# Altium schematic sheet BuckRegulator-5V.SchDoc
size A4; SheetNumber: 4; SheetTotal: 8
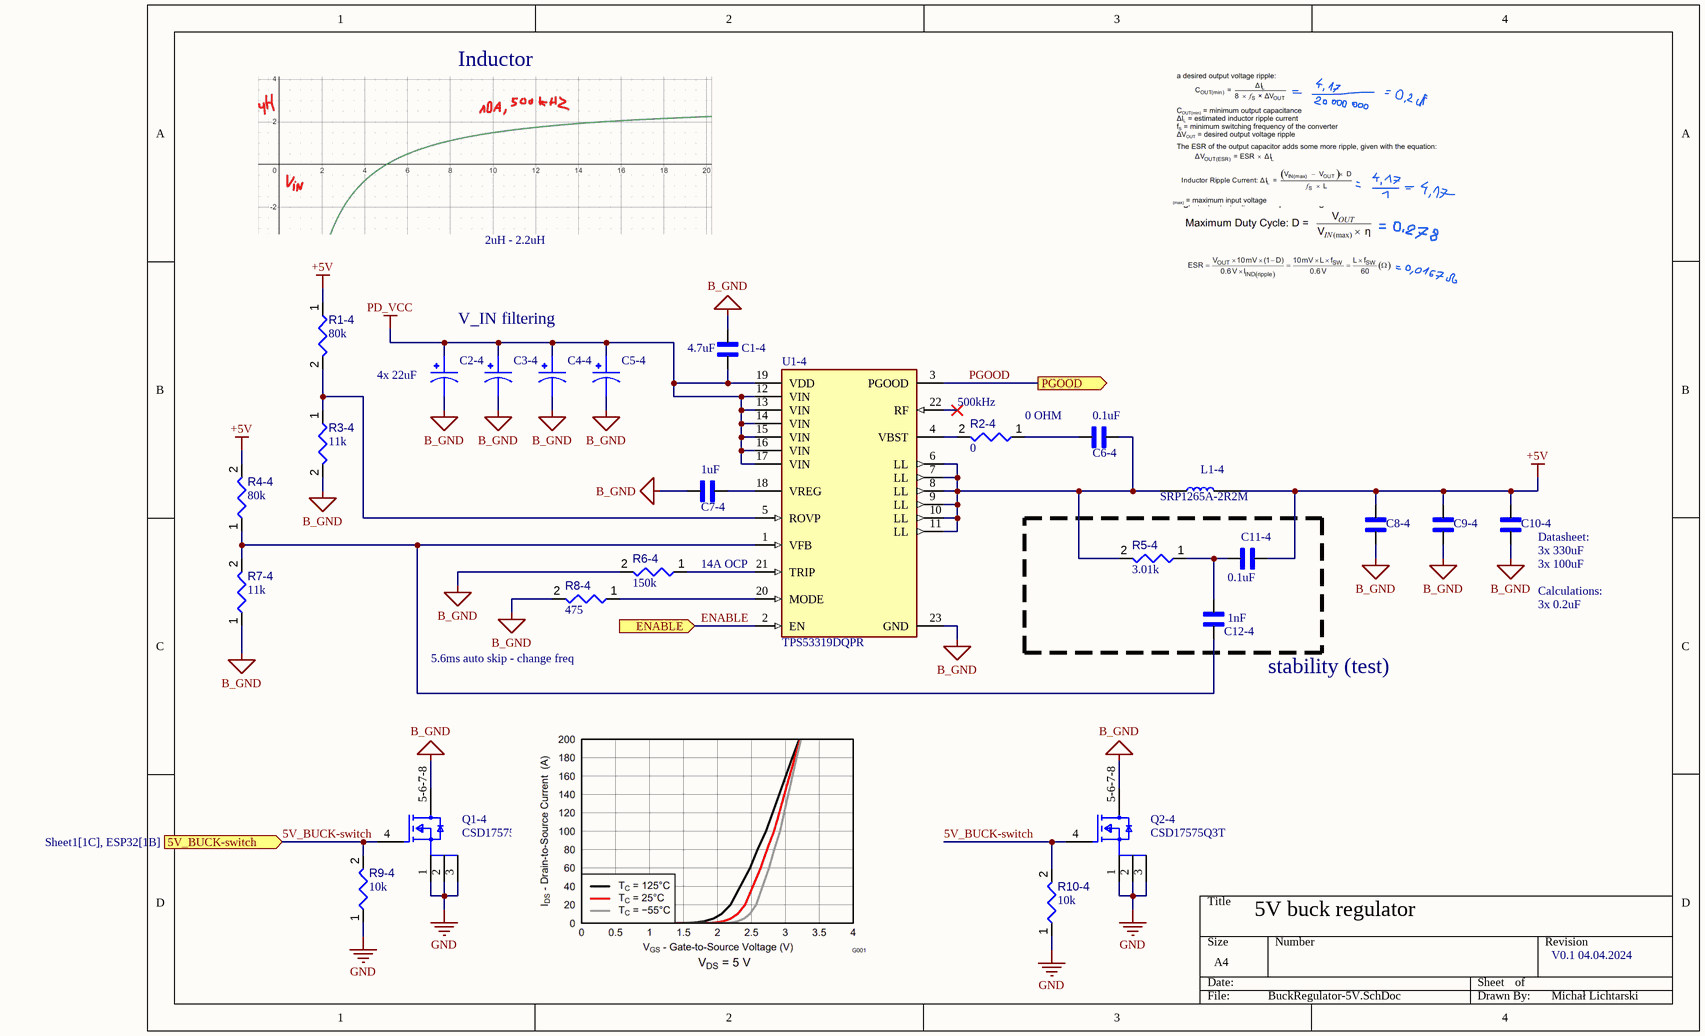
[diagram p0: BuckRegulator-5V.SchDoc]

## Parts
C1-4  4.7uF 0805 35V  [CAPC2012X135N]  (value not drawn)
C2-4  TCJD226M035R0070  [CAPPM7343X310N]  (value not drawn)
C3-4  TCJD226M035R0070  [CAPPM7343X310N]  (value not drawn)
C4-4  TCJD226M035R0070  [CAPPM7343X310N]  (value not drawn)
C5-4  TCJD226M035R0070  [CAPPM7343X310N]  (value not drawn)
C6-4  0.1uF 0603  [CAPC1608X90N]  (value not drawn)
C7-4  1uF 0603  [CAPC2012X140N]  (value not drawn)
C8-4  100uF 10V 1210  [ANTC3225X280N]  (value not drawn)
C9-4  100uF 10V 1210  [ANTC3225X280N]  (value not drawn)
C10-4  100uF 10V 1210  [ANTC3225X280N]  (value not drawn)
C11-4  0.1uF 0603  [CAPC1608X90N]  (value not drawn)
C12-4  1uF 0603  [CAPC1608X90N]  (value not drawn)
L1-4  SRP1265A-2R2M  [IND_SRP1265A-330M]
Q1-4  CSD17575Q3T  [FP-DQG0008A-MFG]
Q2-4  CSD17575Q3T  [FP-DQG0008A-MFG]
R1-4  value 80k  [RESC1608X55X25ML10T15]  (hidden comment: 80k 0603)
R2-4  value 0  [RESC1608X55X25ML10T15]  (hidden comment: 0 0603)
R3-4  value 11k  [RESC1608X55X25ML10T15]  (hidden comment: 11k 0603)
R4-4  value 80k  [RESC1608X55X25ML10T15]  (hidden comment: 80k 0603)
R5-4  value 3.01k  [RESC1608X55X25ML10T15]  (hidden comment: 3.01k 0603)
R6-4  value 150k  [RESC1608X55X25ML10T15]  (hidden comment: 150k 0603)
R7-4  value 11k  [RESC1608X55X25ML10T15]  (hidden comment: 11k 0603)
R8-4  value 475  [RESC1608X55X25ML10T15]  (hidden comment: 475 0603)
R9-4  value 10k  [RESC1608X55X25ML10T15]  (hidden comment: 10k 0603)
R10-4  value 10k  [RESC1608X55X25ML10T15]  (hidden comment: Resistor 4k7 +/-1% 0603 100 mW)
U1-4  TPS53319DQPR  [FP-DQP0022A-MFG]

## Ports
5V_BUCK-switch (in, see Sheet1[1C], ESP32[1B]), ENABLE (in, see Sheet1[1C], ESP32[2B]), PGOOD (out, see Sheet1[1C], ESP32[2B])

## Nets
+5V: C8-4.1 C9-4.1 C10-4.1 C11-4.1 L1-4.2 R1-4.1 R4-4.2
B_GND: C1-4.1 C2-4.2 C3-4.2 C4-4.2 C5-4.2 C7-4.1 C8-4.2 C9-4.2 C10-4.2 Q1-4.5-6-7-8(D) Q2-4.5-6-7-8(D) R3-4.2 R6-4.2 R7-4.1 R8-4.2 U1-4.23(GND)
GND: Q1-4.1(S) Q1-4.2(S) Q1-4.3(S) Q2-4.1(S) Q2-4.2(S) Q2-4.3(S) R9-4.1 R10-4.1
PD_VCC: C1-4.2 C2-4.1 C3-4.1 C4-4.1 C5-4.1 U1-4.12(VIN) U1-4.13(VIN) U1-4.14(VIN) U1-4.15(VIN) U1-4.16(VIN) U1-4.17(VIN) U1-4.19(VDD)
5V_BUCK-switch: Q1-4.4(G) Q2-4.4(G) R9-4.2 R10-4.2 ; port 5V_BUCK-switch
ENABLE: U1-4.2(EN) ; port ENABLE
PGOOD: U1-4.3(PGOOD) ; port PGOOD
NetC6-4_1: C6-4.1 L1-4.1 R5-4.2 U1-4.6(LL) U1-4.7(LL) U1-4.8(LL) U1-4.9(LL) U1-4.10(LL) U1-4.11(LL)
NetC6-4_2: C6-4.2 R2-4.1
NetC7-4_2: C7-4.2 U1-4.18(VREG)
NetC11-4_2: C11-4.2 C12-4.1 R5-4.1
NetC12-4_2: C12-4.2 R4-4.1 R7-4.2 U1-4.1(VFB)
NetR1-4_2: R1-4.2 R3-4.1 U1-4.5(ROVP)
NetR2-4_2: R2-4.2 U1-4.4(VBST)
NetR6-4_1: R6-4.1 U1-4.21(TRIP)
NetR8-4_1: R8-4.1 U1-4.20(MODE)

Not connected (* = marked no-connect by the designer): U1-4 22(RF)*

## Notes on the sheet
- Inductor
- 2uH - 2.2uH
- (near C2-4) 4x 22uF
- V_IN filtering
- (near C1-4) 4.7uF
- 500kHz
- (near R2-4) 0 OHM
- (near C6-4) 0.1uF
- (near C7-4) 1uF
- 14A OCP
- (near C11-4) 0.1uF
- (near C10-4) 3x 330uF
- (near C10-4) 3x 100uF
- (near C10-4) Datasheet:
- (near C12-4) 1nF
- Calculations:
- 3x 0.2uF
- 5.6ms auto skip - change freq
- stability (test)
- 5V buck regulator
- V0.1 04.04.2024
- Michał Lichtarski

## Library data of the parts
C1-4 = CL21A475KLCLQNC: MF: {'manufacturer': u'Samsung'}; Package: None; Price: None; Value: *; MP: CL21A475KLCLQNC; Availability: Unavailable
C2-4 C3-4 C4-4 C5-4 = TPSD107M016S0100: CAP TANT POLY 22UF 35V 2917; MF: {'manufacturer': u'AVX'}; Package: None; Price: None; Value: *; MP: TPSD107M016S0100; Availability: Unavailable
C6-4 C11-4 C12-4 = CL10B104KB8NNNC: MF: {'manufacturer': u'Samsung Electro-Mechanics'}; Package: None; Price: None; Value: *; MP: CL10B104KB8NNNC; Availability: Unavailable
C7-4 = CL21B105KBFNNNE: MF: {'manufacturer': u'Samsung Electro-Mechanics'}; Package: None; Price: None; Value: *; MP: CL21B105KBFNNNE; Availability: Unavailable
C8-4 C9-4 C10-4 = CL32A107MPVNNNE: Cap Ceramic 100uF 10V X5R 20% SMD 1210 85Â°C Embossed T/R; MF: {'manufacturer': u'Samsung Electro-Mechanics'}; Package: None; Price: None; Value: *; MP: CL32A107MPVNNNE; Availability: Unavailable
L1-4 = SRP1265A-330M: Inductor Power Shielded Wirewound 33uH 20% 100KHz Carbonyl Powder 8A 58mOhm DCR Automotive T/R; MF: {'manufacturer': u'Bourns'}; Package: None; Price: None; Value: *; MP: SRP1265A-330M; Availability: Unavailable
Q1-4 Q2-4 = CMP-04962-000079-1: MOSFET N-CH 30V 60A 8VSON; Turn-On Delay Time: 4ns; Threshold Voltage: 1.4V; Element Configuration: Single; Input Capacitance: 4.42nF; Max Power Dissipation: 108W; Rds On Max: 2.3mR; Number of Channels: 1; Gate to Source Voltage (Vgs): 20V; Turn-Off Delay Time: 20ns; Fall Time: 3ns; Rise Time: 10ns; Drain to Source Resistance: 2.6mR; Drain to Source Voltage (Vdss): 30V; Mount: Surface Mount; Continuous Drain Current (ID): 60A; Packaging: Tape and Reel; Min Operating Temperature: -55°C; Package Quantity: 250; RoHS Compliant: Yes; Max Operating Temperature: 150°C; Weight: 0.000847oz; REACH SVHC: No SVHC; Number of Pins: 8; Lead Free: Contains Lead; Contact Plating: Tin
R1-4 R2-4 R3-4 R4-4 R5-4 R6-4 R7-4 R9-4 = CMP-009-00031-5: Tolerance: 1%; Power: 100mW; Mounting Technology: SM; Case/Package: 0603; RoHS Compliant: True; Pins: 2; Min Operating Temperature: -55°C; Max Operating Temperature: 155°C
R8-4 R10-4 = CMP-009-00031-5: Chip Resistor, 4.7 KOhm, +/- 1%, 0.1 W, -55 to 155 degC, 0603 (1608 Metric); Power: 100mW; Tolerance: 1%; Mounting Technology: SM; Case/Package: 0603; RoHS Compliant: True; Pins: 2; Min Operating Temperature: -55°C; Max Operating Temperature: 155°C
U1-4 = CMP-04918-000329-1: IC REG BUCK ADJUSTABLE 14A 22SON; Output Voltage: 5.5V; Output Configuration: Positive; Quiescent Current: 320uA; Number of Outputs: 1; Min Output Voltage: 600mV; Max Input Voltage: 22V; Switching Frequency: 1MHz; Min Input Voltage: 1.5V; Efficiency: 91%; Synchronous Rectifier: Yes; Output Type: Adjustable; Series: D-CAP™, Eco-Mode™; Max Output Voltage: 5.5V; Case/Package: SON; Packaging: Tape and Reel; Lead Free: Contains Lead; Number of Pins: 22; Output Current: 14A; Min Operating Temperature: -40°C; Mount: Surface Mount; Radiation Hardening: No; Contact Plating: Gold; RoHS Compliant: Yes; Max Operating Temperature: 85°C; Max Output Current: 14A; Package Quantity: 2500